# Altium project ECE453-Custom.PrjPcb
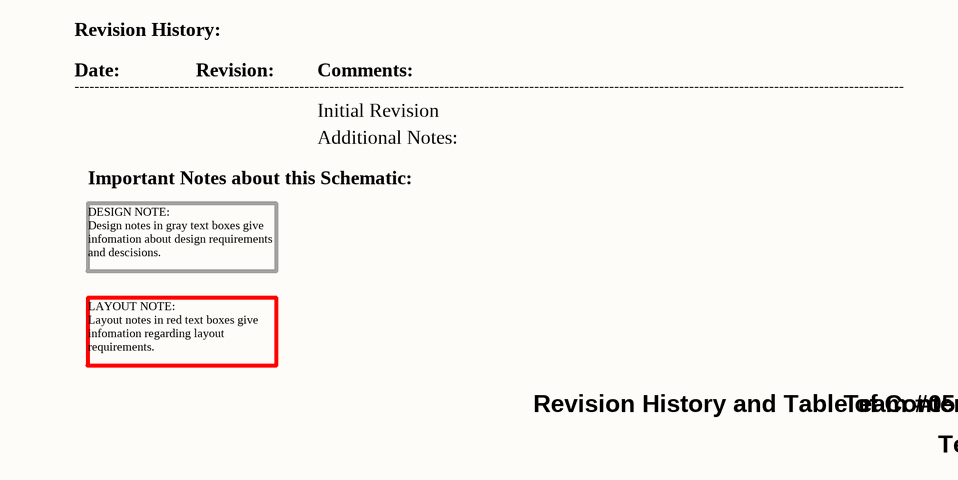
[diagram p0: 01-Revision_History_and_Contents.SchDoc]
3 sheets, 13 parts. Net scope: global (net labels, ports and power ports of the same name join across sheets).
Board file: ECE453_Custom.PcbDoc
Sheets:
  01-Revision_History_and_Contents.SchDoc
  02-Mezzanine.SchDoc
  03_Mechanicals.SchDoc

## Sheet 01-Revision_History_and_Contents.SchDoc: Revision History and Contents
size A; Date: 4/25/2017; ApprovedBy: JSK; CheckedBy: JSK; Author: JSK; CompanyName: University of Wisconsin; DrawnBy: JSK; Engineer: JSK; Organization: ECE 315; Address1: College of Engineering; Address2: 1415 Engineering Drive; Address3: Madison, WI 53706; Address4: ECE 453 Spring 2017; Revision: A; SheetNumber: 1; SheetTotal: 2

### Notes on the sheet
- Revision History:
- Date:
- ----------------------------------------------------------------------------------------------------------------------------------------------------------------------
- Revision:
- Comments:
- Initial Revision
- Important Notes about this Schematic:
- Additional Notes:
- DESIGN NOTE:
  Design notes in gray text boxes give infomation about design requirements and descisions.
- LAYOUT NOTE:
  Layout notes in red text boxes give infomation regarding layout requirements.
- Revision History and Table of Contents
- Team #05
- Team Members: Grant, John, Val, Sree, Akash

## Sheet 02-Mezzanine.SchDoc: ECE453 Power
size A; Date: 4/25/2017; ApprovedBy: JSK; CheckedBy: JSK; Author: JSK; CompanyName: University of Wisconsin; DrawnBy: JSK; Engineer: JSK; Organization: ECE 315; Address1: College of Engineering; Address2: 1415 Engineering Drive; Address3: Madison, WI 53706; Address4: ECE 453 Fall 2022; Revision: A; SheetNumber: 2; SheetTotal: 2; AssemblyNumber: ECE453-F22-01
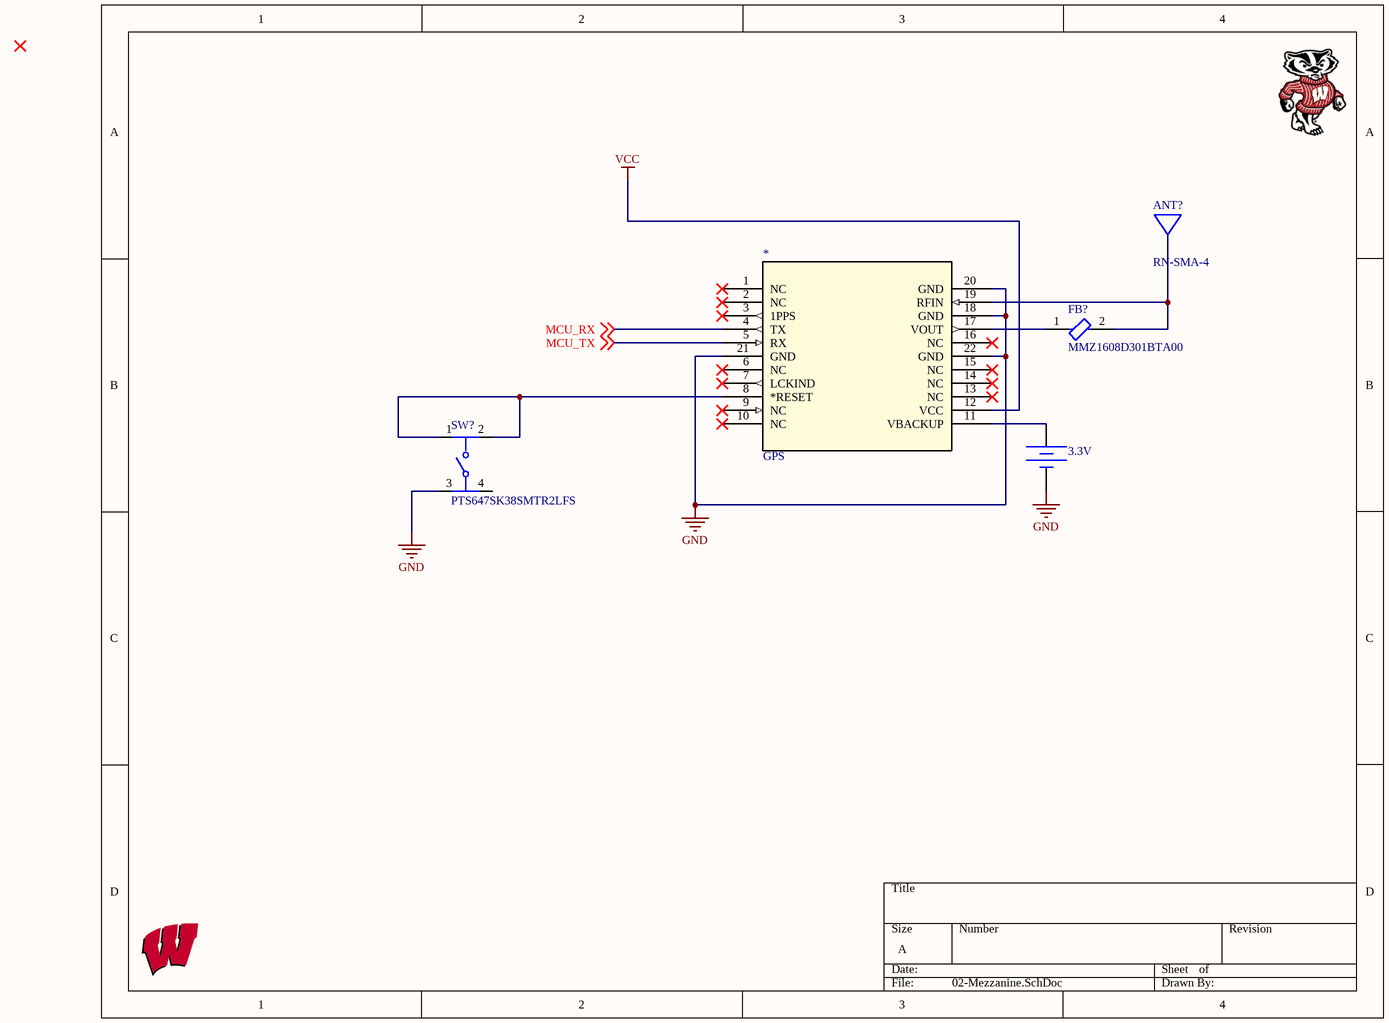
[diagram p1: 02-Mezzanine.SchDoc]

### Parts
3.3V  Constant Voltage Source  (value not drawn)
*  GPS
ANT?  RN-SMA-4  [FP-RN-SMA-4-MFG]
FB?  MMZ1608D301BTA00  [FP-MMZ1608-0_8-MFG]
SW?  PTS647SK38SMTR2LFS  [FP-PTS647SK38SMTR2LFS-MFG]

### Nets
GND: 3.3V.2 *.18(GND) *.20(GND) *.21(GND) *.22(GND) SW?.3
VCC: *.12(VCC)
MCU_RX: *.4(TX) ; off-sheet MCU_RX
MCU_TX: *.5(RX) ; off-sheet MCU_TX
Net3.3V_1: 3.3V.1 *.11(VBACKUP)
Net*_8: *.8(*RESET) SW?.1 SW?.2
Net*_17: *.17(VOUT) FB?.1
Net*_19: *.19(RFIN) FB?.2

Not connected (* = marked no-connect by the designer): * 1(NC)* 2(NC)* 3(1PPS)* 6(NC)* 7(LCKIND)* 9(NC)* 10(NC)* 13(NC)* 14(NC)* 15(NC)* 16(NC)*; SW? 4

### Library data of the parts
3.3V = Battery: SimulationGenericComponent: True; DC Magnitude: 5
ANT? = CMP-06329-000002-1: RF ANT 2.4GHZ WHIP SMA MALE 4"; Number of Bands: 1; Input Impedance: 50R; VSWR: 1.9; Bandwidth: 120MHz; Frequency: 2.45GHz; REACH SVHC: No SVHC; Height: 4.449inch; Packaging: Bulk; Case/Package: SMA; Package Quantity: 1; Lead Free: Lead Free; Series: -; Termination: SMA; Connector Type: SMA; Radiation Hardening: No; Impedance: 50R; Mount: Connector
FB? = CMP-08257-000452-1: Signal Line Ferrite Bead 300Ω  @ 100MHz 300mA DCR 700mΩ SMD 0603; DC Resistance (DCR): 700mR; Impedance: 300R; Case/Package: 0603; Max DC Current: 300mA; REACH SVHC: No SVHC; Case Code (Imperial): 0603; Case Code (Metric): 1608; Length: 0.063inch; Mount: Surface Mount; RoHS Compliant: Yes; Current Rating: 300mA; Packaging: Cut Tape; Width: 0.031inch; Height: 0.037inch; Package Quantity: 4000; Series: MMZ
SW? = CMP-10040-000033-1: TACT 4.5 X 4.5, 3.8 MM H, 2.5N,; Switch Function: Off-Mom; Switch Travel: 0.25mm; Actuator Type: Standard; Illumination Type: Non-Illuminated; Mechanical Life: 100000Cycles; Ratings: IP40; Operating Force: 250gf; Throw Configuration: SPST; Max Operating Temperature: 70°C; Min Operating Temperature: -20°C; Termination: Gull Wing; Mount: Surface Mount; Packaging: Tape and Reel

## Sheet 03_Mechanicals.SchDoc
size A; ApprovedDate: 04/02/2019; AssemblyNumber: ECE315-F19
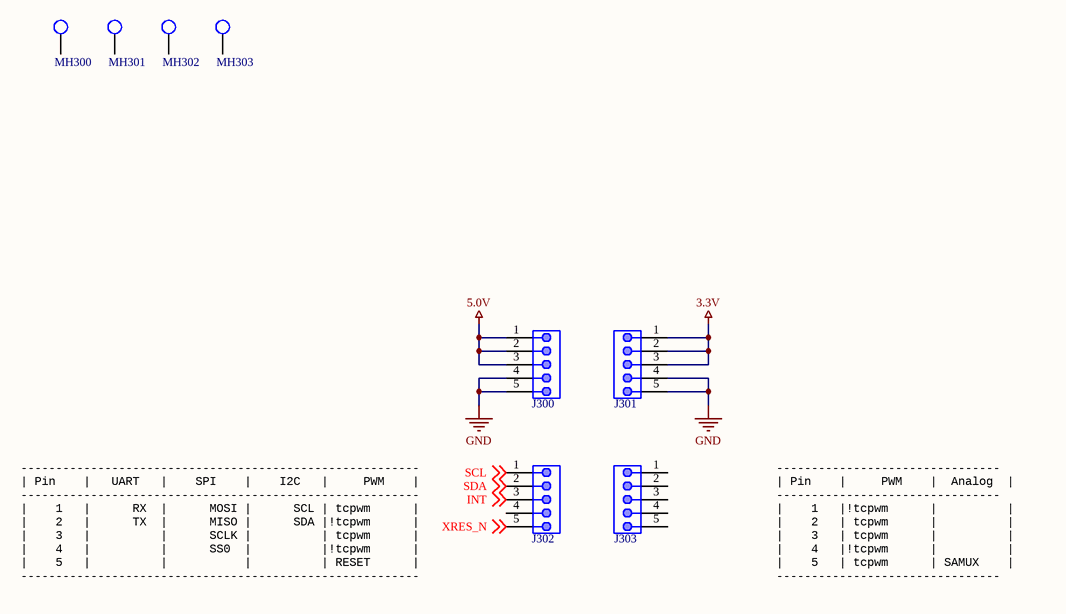
[diagram p2: 03_Mechanicals.SchDoc]

### Parts
J300  CONN_HEADER_MALE_1x5  [HDR1X5]  (value not drawn)
J301  CONN_HEADER_MALE_1x5  [HDR1X5]  (value not drawn)
J302  CONN_HEADER_MALE_1x5  [HDR1X5]  (value not drawn)
J303  CONN_HEADER_MALE_1x5  [HDR1X5]  (value not drawn)
MH300  MHOLE_2_55MM  [MHOLE_2_55MM]  (value not drawn)  (no BOM)
MH301  MHOLE_2_55MM  [MHOLE_2_55MM]  (value not drawn)  (no BOM)
MH302  MHOLE_2_55MM  [MHOLE_2_55MM]  (value not drawn)  (no BOM)
MH303  MHOLE_2_55MM  [MHOLE_2_55MM]  (value not drawn)  (no BOM)

### Nets
3.3V: J301.1 J301.2 J301.3
5.0V: J300.1 J300.2 J300.3
GND: J300.4 J300.5 J301.4 J301.5
INT: J302.3 ; off-sheet INT
SCL: J302.1 ; off-sheet SCL
SDA: J302.2 ; off-sheet SDA
XRES_N: J302.5 ; off-sheet XRES_N

Not connected (* = marked no-connect by the designer): J302 4; J303 1 2 3 4 5; MH300 1; MH301 1; MH302 1; MH303 1

### Notes on the sheet
- ---------------------------------------------------------
  | Pin    |   UART   |    SPI    |    I2C   |     PWM    |
  ---------------------------------------------------------
  |    1   |      RX  |      MOSI |      SCL | tcpwm      |
  |    2   |      TX  |      MISO |      SDA |!tcpwm      |
  |    3   |          |      SCLK |          | tcpwm      |
  |    4   |          |      SS0  |          |!tcpwm      |
  |    5   |          |           |          | RESET      |
  ---------------------------------------------------------
- --------------------------------
  | Pin    |     PWM    |  Analog  |
  --------------------------------
  |    1   |!tcpwm      |          |
  |    2   | tcpwm      |          |
  |    3   | tcpwm      |          |
  |    4   |!tcpwm      |          |
  |    5   | tcpwm      | SAMUX    |
  --------------------------------

### Library data of the parts
J300-J303 = CONN_HEADER_MALE_1x5: Header, 5-Pin; Manufacturer 1: Sullins; Manufacturer Part Number 1: PREC005SACN-RC; Number of Positions: 5; Connector Type: Male Pin; Pitch: 0.1inch; ComponentLink1URL: http://www.farnell.com/cad/1737268.pdf; ComponentLink1Description: http://www.farnell.com/cad/1737268.pdf; ComponentLink2URL: http://katalog.we-online.de/em/datasheet/6130xx11121.pdf; ComponentLink2Description: http://katalog.we-online.de/em/datasheet/6130xx11121.pdf; Supplier 1: Digi-Key; Stock 1: 0; Pricing 1: 1=0.19000, 10=0.17400, 25=0.12960, 50=0.11120, 100=0.10740, 250=0.09264, 500=0.08892 (USD); RoHS: Yes; Mount: Through Hole; Color: Black; Contact Plating: Tin; Package Quantity: 1; Number of Rows: 1; Packaging: Bulk; Termination: Solder; Contact Mating Length: 0.23inch; ComponentLink3URL: https://datasheet.ciiva.com/741/xrxczzzsxxn-rc-st-11635-b-741840.pdf?src-supplier=Digi-Key; ComponentLink3Description: https://datasheet.ciiva.com/741/xrxczzzsxxn-rc-st-11635-b-741840.pdf?src-supplier=Digi-Key; Supplier Part Number 1: S1032EC-05-ND
MH300-MH303 = MHOLE_2_55MM: Mounting Holde; Manufacturer Part Number: UW MTHOLE

## Nets that join several sheets
GND: 02-Mezzanine (6 pins), 03_Mechanicals (J300.4 J300.5 J301.4 J301.5)